# Altium schematic sheet Sheet-ForNAProj.SchDoc
size B; SheetNumber: 1; SheetTotal: 1; SPICEModelCacheKCHORGNF: <root> / <DocumentId>KCHORGNF</DocumentId> / <CacheFrame Number="0"> / <Model Name="led0" Kind="MDL"> / <Text>*Typ INFRARED GaAs LED: Vf=1.2V Vr=5V If=40mA trr=3uS / *LED Pinout: 1=A, 2=K / .MODEL LED0 D (IS=93.5P RS=84M N=2.63 BV=5 IBV=10U / + CJO=2.97P VJ=.75 M=.333 TT=4.32U)</Text> / </Model> / <Model Name="xtal" Kind="CKT"> / <Text>*Generic type:crystal pkg:HC33/51 / .SUBCKT XTAL 1 2 PARAMS: FREQ=1Meg RS=750 C=13pf Q=1000 / LX 1 3 {((Q*RS)/(6.2831852*FREQ))} IC=0.5M / CX 3 4 {(1/(Q*6.2831852*FREQ*RS))} / C0 1 2 {C} / RS 4 2 {RS} / .ENDS XTAL</Text> / </Model> / <Model Name="1n4007" Kind="MDL"> / <Text>*1N4007 MCE 8-16-95 / *1000V 1A Si GenPurpose Diode pkg:DIODE0.4 1,2 / .MODEL 1N4007 D(IS=2.55E-9 RS=0.042 N=1.75 TT=5.76E-6 CJO=1.85E-11 / + VJ=0.75 M=0.333 BV=1000 IBV=9.86E-5 )</Text> / </Model> / </CacheFrame> / </root>
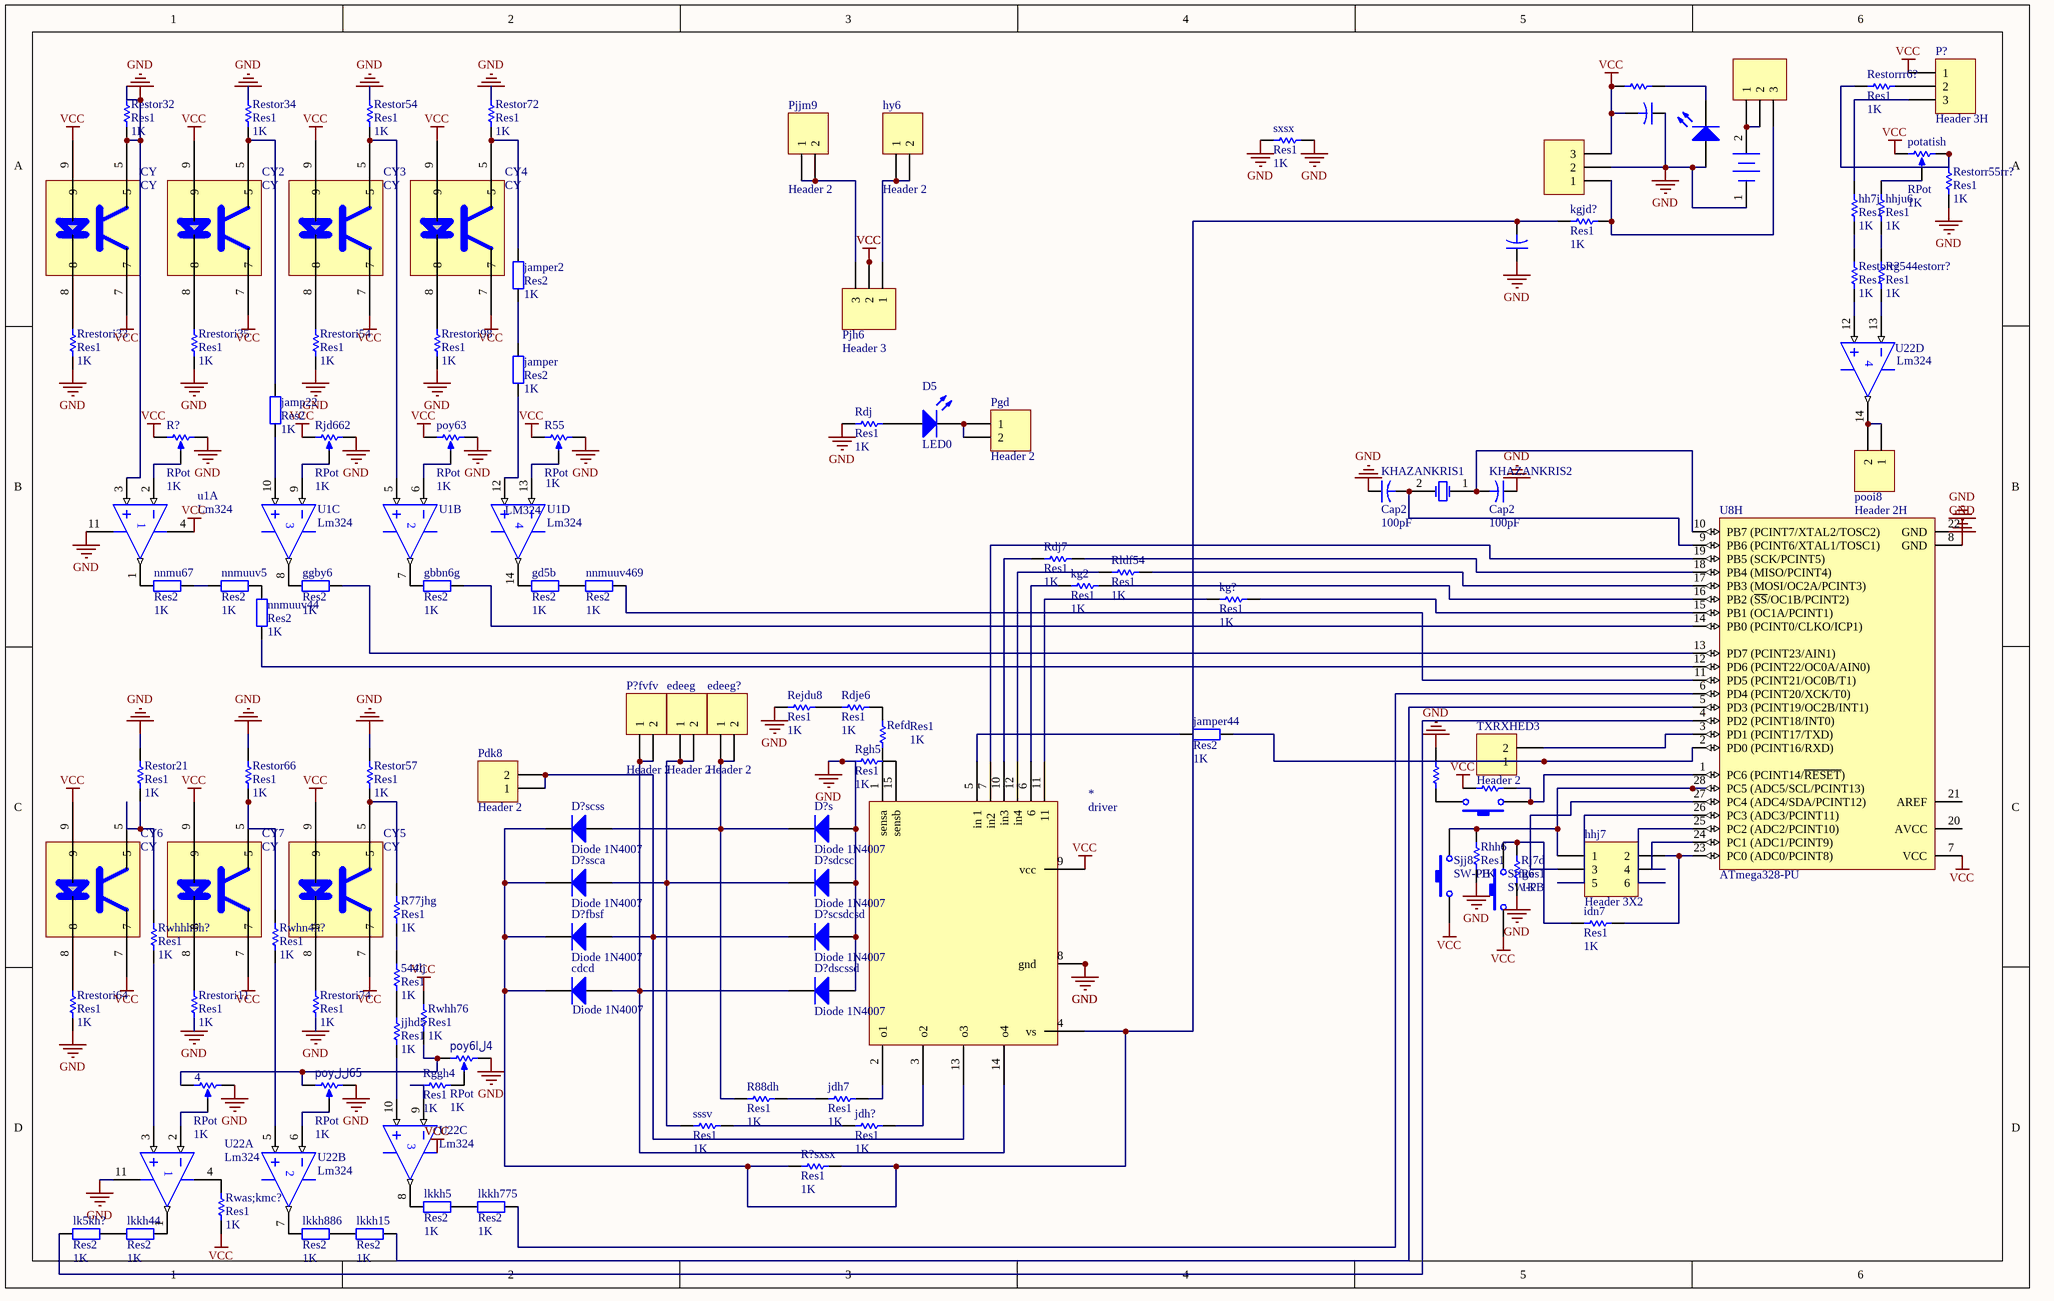
[diagram p0: Sheet-ForNAProj.SchDoc]

## Parts
4  RPot  value 1K  [VR5]
544lj  Res1  value 1K  [AXIAL-0.3]
*  driver  [PCBComponent_1]
cdcd  Diode 1N4007  [DO-41]
CMain?  Cap2IN  [CAPR5-4X5]  (value not drawn)
CMainb?  Cap2IN  [CAPR5-4X5]  (value not drawn)
CY  CY  [CY70]
CY2  CY  [CY70]
CY3  CY  [CY70]
CY4  CY  [CY70]
CY5  CY  [CY70]
CY6  CY  [CY70]
CY7  CY  [CY70]
D5  LED0  [LED-0]
D?dscssd  Diode 1N4007  [DO-41]
D?fbsf  Diode 1N4007  [DO-41]
D?s  Diode 1N4007  [DO-41]
D?scsdcsd  Diode 1N4007  [DO-41]
D?scss  Diode 1N4007  [DO-41]
D?sdcsc  Diode 1N4007  [DO-41]
D?ssca  Diode 1N4007  [DO-41]
edeeg  Header 2  [HDR1X2]
edeeg?  Header 2  [HDR1X2]
gbbn6g  Res2  value 1K  [AXIAL-0.4]
gd5b  Res2  value 1K  [AXIAL-0.4]
ggby6  Res2  value 1K  [AXIAL-0.4]
hh7j  Res1  value 1K  [AXIAL-0.3]
hhj7  Header 3X2  [HDR2X3]
hhju6  Res1  value 1K  [AXIAL-0.3]
hy6  Header 2  [HDR1X2]
idn7  Res1  value 1K  [AXIAL-0.3]
jamp22  Res2  value 1K  [AXIAL-0.4]
jamper  Res2  value 1K  [AXIAL-0.4]
jamper2  Res2  value 1K  [AXIAL-0.4]
jamper44  Res2  value 1K  [AXIAL-0.4]
jdh7  Res1  value 1K  [AXIAL-0.3]
jdh?  Res1  value 1K  [AXIAL-0.3]
jjhd5  Res1  value 1K  [AXIAL-0.3]
KEYM  Header 3  [HDR1X3]  (value not drawn)
kg2  Res1  value 1K  [AXIAL-0.3]
kg?  Res1  value 1K  [AXIAL-0.3]
kgjd?  Res1  value 1K  [AXIAL-0.3]
KHAZANKRIS1  Cap2  value 100pF  [CAPR5-4X5]
KHAZANKRIS2  Cap2  value 100pF  [CAPR5-4X5]
LEDMIAN  LED0  [LED-0]  (value not drawn)
lk5kh?  Res2  value 1K  [AXIAL-0.4]
lkkh5  Res2  value 1K  [AXIAL-0.4]
lkkh15  Res2  value 1K  [AXIAL-0.4]
lkkh44  Res2  value 1K  [AXIAL-0.4]
lkkh775  Res2  value 1K  [AXIAL-0.4]
lkkh886  Res2  value 1K  [AXIAL-0.4]
Main_BT_9_-_15_V  Battery Main  [BAT-2]  (value not drawn)
nnmu67  Res2  value 1K  [AXIAL-0.4]
nnmuuv5  Res2  value 1K  [AXIAL-0.4]
nnmuuv44  Res2  value 1K  [AXIAL-0.4]
nnmuuv469  Res2  value 1K  [AXIAL-0.4]
P?  Header 3H  [HDR1X3H]
P?fvfv  Header 2  [HDR1X2]
Pdk8  Header 2  [HDR1X2]
Pgd  Header 2  [HDR1X2]
Pjh6  Header 3  [HDR1X3]
Pjjm9  Header 2  [HDR1X2]
pooi8  Header 2H  [HDR1X2H]
potatish  RPot  value 1K  [VR5]
poy6ال4  RPot  value 1K  [VR5]
poy63  RPot  value 1K  [VR5]
poyلل65  RPot  value 1K  [VR5]
R55  RPot  value 1K  [VR5]
R77jhg  Res1  value 1K  [AXIAL-0.3]
R88dh  Res1  value 1K  [AXIAL-0.3]
R?  RPot  value 1K  [VR5]
R?sxsx  Res1  value 1K  [AXIAL-0.3]
Rdj  Res1  value 1K  [AXIAL-0.3]
Rdj7  Res1  value 1K  [AXIAL-0.3]
Rdje6  Res1  value 1K  [AXIAL-0.3]
Refd  Res1  value 1K  [AXIAL-0.3]
regolator  Header 3  [HDR1X3]  (value not drawn)
Rejdu8  Res1  value 1K  [AXIAL-0.3]
Res_LED  Res 220 LED  [AXIAL-0.3]  (value not drawn)
RESF210K  Res1  [AXIAL-0.3]  (value not drawn)
REST3100  Res1  [AXIAL-0.3]  (value not drawn)
Restor21  Res1  value 1K  [AXIAL-0.3]
Restor32  Res1  value 1K  [AXIAL-0.3]
Restor34  Res1  value 1K  [AXIAL-0.3]
Restor54  Res1  value 1K  [AXIAL-0.3]
Restor57  Res1  value 1K  [AXIAL-0.3]
Restor66  Res1  value 1K  [AXIAL-0.3]
Restor72  Res1  value 1K  [AXIAL-0.3]
Restorr55rr?  Res1  value 1K  [AXIAL-0.3]
Restorr?  Res1  value 1K  [AXIAL-0.3]
Restorrr6?  Res1  value 1K  [AXIAL-0.3]
Rg544estorr?  Res1  value 1K  [AXIAL-0.3]
Rggh4  Res1  value 1K  [AXIAL-0.3]
Rgh5  Res1  value 1K  [AXIAL-0.3]
Rhh6  Res1  value 1K  [AXIAL-0.3]
Rj7d  Res1  value 1K  [AXIAL-0.3]
Rjd662  RPot  value 1K  [VR5]
Rldf54  Res1  value 1K  [AXIAL-0.3]
Rrestori11  Res1  value 1K  [AXIAL-0.3]
Rrestori33  Res1  value 1K  [AXIAL-0.3]
Rrestori35  Res1  value 1K  [AXIAL-0.3]
Rrestori54  Res1  value 1K  [AXIAL-0.3]
Rrestori64  Res1  value 1K  [AXIAL-0.3]
Rrestori74  Res1  value 1K  [AXIAL-0.3]
Rrestori98  Res1  value 1K  [AXIAL-0.3]
Rwas;kmc?  Res1  value 1K  [AXIAL-0.3]
Rwhh76  Res1  value 1K  [AXIAL-0.3]
Rwhhh6h?  Res1  value 1K  [AXIAL-0.3]
Rwhn4h?  Res1  value 1K  [AXIAL-0.3]
Sffg6  SW-PB  [SPST-2]
Sjj8  SW-PB  [SPST-2]
sssv  Res1  value 1K  [AXIAL-0.3]
SWRESET  SW-PB  [SPST-2]  (value not drawn)
sxsx  Res1  value 1K  [AXIAL-0.3]
TXRXHED3  Header 2  [HDR1X2]
u1  Lm324  [Lm324]  (parts A,B,C,D of 4)
U8H  ATmega328-PU  [28P3]
U22  Lm324  [Lm324]  (parts A,B,C,D of 4)
XTAL16MG  XTAL  [R38]  (value not drawn)

## Nets
GND: 4.2(BOT) *.8(gnd) CMain?.1 CMainb?.1 CY.5 D?dscssd.1(A) D?s.1(A) D?scsdcsd.1(A) D?sdcsc.1(A) KHAZANKRIS1.1 KHAZANKRIS2.1 LEDMIAN.1(A) Main_BT_9_-_15_V.1(+) poy6ال4.2(BOT) poy63.2(BOT) poyلل65.2(BOT) R55.2(BOT) R?.2(BOT) Rdj.1 regolator.2 Rejdu8.2 REST3100.1 Restor21.2 Restor32.1 Restor32.2 Restor34.2 Restor54.2 Restor57.2 Restor66.2 Restor72.2 Restorr55rr?.2 Rgh5.1 Rhh6.1 Rj7d.1 Rjd662.2(BOT) Rrestori11.1 Rrestori33.1 Rrestori35.1 Rrestori54.1 Rrestori64.1 Rrestori74.1 Rrestori98.1 sxsx.1 sxsx.2 u1.3(IN+) u1.11(V-) U8H.8(GND) U8H.22(GND) U22.11(V-)
VCC: *.9(vcc) CMain?.2 CY.7 CY.9 CY2.7 CY2.9 CY3.7 CY3.9 CY4.7 CY4.9 CY5.7 CY5.9 CY6.7 CY6.9 CY7.7 CY7.9 P?.1 Pjh6.2 potatish.1(TOP) poy63.1(TOP) R55.1(TOP) R?.1(TOP) regolator.3 Res_LED.1 RESF210K.1 Rjd662.1(TOP) Rwas;kmc?.2 Rwhh76.1 Sffg6.1 Sjj8.1 u1.4(V+) U8H.7(VCC)
Net4_1: 4.1(TOP) poy6ال4.1(TOP) poyلل65.1(TOP) Rwhh76.2
Net4_3: 4.3(TAP) U22.2(IN-)
Net544lj_1: 544lj.1 R77jhg.2
Net544lj_2: 544lj.2 jjhd5.1
Net*_1: *.1(sensa) Refd.1
Net*_2: *.2(o1) jdh7.2
Net*_3: *.3(o2) jdh?.2
Net*_4: *.4(vs) cdcd.2(K) CMainb?.2 D?fbsf.2(K) D?scss.2(K) D?ssca.2(K) kgjd?.1 R?sxsx.1 R?sxsx.2
Net*_5: *.5(in_1) jamper44.1
Net*_6: *.6 kg2.2
Net*_7: *.7(in2) U8H.19(PB5_(SCK/PCINT5))
Net*_10: *.10(in3) Rdj7.2
Net*_11: *.11 kg?.2
Net*_12: *.12(in4) Rldf54.2
Net*_13: *.13(o3) D?fbsf.1(A) D?scsdcsd.2(K) Pdk8.1 Pdk8.2
Net*_14: *.14(o4) cdcd.1(A) D?dscssd.2(K) P?fvfv.1 P?fvfv.2
Net*_15: *.15(sensb) Rgh5.2
NetCY2_5: CY2.5 jamp22.2 Restor34.1
NetCY2_8: CY2.8 Rrestori35.2
NetCY3_5: CY3.5 Restor54.1 U1.5(IN+)
NetCY3_8: CY3.8 Rrestori54.2
NetCY4_5: CY4.5 jamper2.2 Restor72.1
NetCY4_8: CY4.8 Rrestori98.2
NetCY5_5: CY5.5 R77jhg.1 Restor57.1
NetCY5_8: CY5.8 Rrestori74.2
NetCY6_5: CY6.5 Restor21.1 Rwhhh6h?.1
NetCY6_8: CY6.8 Rrestori64.2
NetCY7_5: CY7.5 Restor66.1 Rwhn4h?.1
NetCY7_8: CY7.8 Rrestori11.2
NetCY_8: CY.8 Rrestori33.2
NetD5_1: D5.1(A) Rdj.2
NetD5_2: D5.2(K) Pgd.1 Pgd.2
NetD?s_2: D?s.2(K) D?scss.1(A) edeeg?.1 edeeg?.2 R88dh.1
NetD?sdcsc_2: D?sdcsc.2(K) D?ssca.1(A) edeeg.1 edeeg.2 sssv.1
Netgbbn6g_1: gbbn6g.1 U1.7(OUT)
Netgbbn6g_2: gbbn6g.2 U8H.14(PB0_(PCINT0/CLKO/ICP1))
Netgd5b_1: gd5b.1 U1.14(OUT)
Netgd5b_2: gd5b.2 nnmuuv469.1
Netggby6_1: ggby6.1 U1.8(OUT)
Netggby6_2: ggby6.2 U8H.13(PD7_(PCINT23/AIN1))
Nethh7j_1: hh7j.1 P?.3
Nethh7j_2: hh7j.2 Restorr?.1
Nethhj7_1: hhj7.1 Rhh6.2 Sjj8.2 U8H.28(PC5_(ADC5/SCL/PCINT13))
Nethhj7_2: hhj7.2 idn7.2 U8H.23(PC0_(ADC0/PCINT8))
Nethhj7_3: hhj7.3 U8H.27(PC4_(ADC4/SDA/PCINT12))
Nethhj7_4: hhj7.4 U8H.24(PC1_(ADC1/PCINT9))
Nethhj7_5: hhj7.5 U8H.26(PC3_(ADC3/PCINT11))
Nethhj7_6: hhj7.6 U8H.25(PC2_(ADC2/PCINT10))
Nethhju6_1: hhju6.1 Rg544estorr?.1
Nethhju6_2: hhju6.2 potatish.3(TAP)
Nethy6_1: hy6.1 hy6.2 Pjh6.1
Netidn7_1: idn7.1 Rj7d.2 Sffg6.2
Netjamp22_1: jamp22.1 U1.10(IN+)
Netjamper44_2: jamper44.2 TXRXHED3.1 U8H.2(PD0_(PCINT16/RXD))
Netjamper_1: jamper.1 U1.12(IN+)
Netjamper_2: jamper.2 jamper2.1
Netjdh7_1: jdh7.1 R88dh.2
Netjdh?_1: jdh?.1 sssv.2
Netjjhd5_2: jjhd5.2 U22.10(IN+)
NetKEYM_1: KEYM.1 KEYM.2 Main_BT_9_-_15_V.2(-)
NetKEYM_3: KEYM.3 kgjd?.2 regolator.1
Netkg2_1: kg2.1 U8H.16(PB2_(~{SS}/OC1B/PCINT2))
Netkg?_1: kg?.1 U8H.15(PB1_(OC1A/PCINT1))
NetKHAZANKRIS1_2: KHAZANKRIS1.2 U8H.9(PB6_(PCINT6/XTAL1/TOSC1)) XTAL16MG.2(OSC2)
NetKHAZANKRIS2_2: KHAZANKRIS2.2 U8H.10(PB7_(PCINT7/XTAL2/TOSC2)) XTAL16MG.1(OSC1)
NetLEDMIAN_2: LEDMIAN.2(K) Res_LED.2
Netlk5kh?_1: lk5kh?.1 U8H.4(PD2_(PCINT18/INT0))
Netlk5kh?_2: lk5kh?.2 lkkh44.1
Netlkkh5_1: lkkh5.1 U22.8(OUT)
Netlkkh5_2: lkkh5.2 lkkh775.1
Netlkkh15_1: lkkh15.1 lkkh886.2
Netlkkh15_2: lkkh15.2 U8H.5(PD3_(PCINT19/OC2B/INT1))
Netlkkh44_2: lkkh44.2 U22.1(OUT)
Netlkkh775_2: lkkh775.2 U8H.6(PD4_(PCINT20/XCK/T0))
Netlkkh886_1: lkkh886.1 U22.7(OUT)
Netnnmu67_1: nnmu67.1 u1.1(OUT)
Netnnmu67_2: nnmu67.2 nnmuuv5.1
Netnnmuuv5_2: nnmuuv5.2 nnmuuv44.2
Netnnmuuv44_1: nnmuuv44.1 U8H.12(PD6_(PCINT22/OC0A/AIN0))
Netnnmuuv469_2: nnmuuv469.2 U8H.11(PD5_(PCINT21/OC0B/T1))
NetP?_2: P?.2 Restorrr6?.1
NetPjh6_3: Pjh6.3 Pjjm9.1 Pjjm9.2
Netpooi8_1: pooi8.1 pooi8.2 U22.14(OUT)
Netpotatish_2: potatish.2(BOT) Restorr55rr?.1 Restorrr6?.2
Netpoy6ال4_3: poy6ال4.3(TAP) Rggh4.2
Netpoy63_3: poy63.3(TAP) U1.6(IN-)
Netpoyلل65_3: poyلل65.3(TAP) U22.6(IN-)
NetR55_3: R55.3(TAP) U1.13(IN-)
NetR?_3: R?.3(TAP) u1.2(IN-)
NetRdj7_1: Rdj7.1 U8H.18(PB4_(MISO/PCINT4))
NetRdje6_1: Rdje6.1 Refd.2
NetRdje6_2: Rdje6.2 Rejdu8.1
NetRESF210K_2: RESF210K.2 SWRESET.1 U8H.1(PC6_(PCINT14/~{RESET}))
NetREST3100_2: REST3100.2 SWRESET.2
NetRestorr?_2: Restorr?.2 U22.12(IN+)
NetRg544estorr?_2: Rg544estorr?.2 U22.13(IN-)
NetRggh4_1: Rggh4.1 U22.9(IN-)
NetRjd662_3: Rjd662.3(TAP) U1.9(IN-)
NetRldf54_1: Rldf54.1 U8H.17(PB3_(MOSI/OC2A/PCINT3))
NetRwas;kmc?_1: Rwas;kmc?.1 U22.4(V+)
NetRwhhh6h?_2: Rwhhh6h?.2 U22.3(IN+)
NetRwhn4h?_2: Rwhn4h?.2 U22.5(IN+)
NetTXRXHED3_2: TXRXHED3.2 U8H.3(PD1_(PCINT17/TXD))

Not connected (* = marked no-connect by the designer): U8H 20(AVCC) 21(AREF)

## Library data of the parts
4 potatish poy6ال4 poy63 poyلل65 R55 R? Rjd662 = RPot: Potentiometer; Sim Note: Enter the Resistance value and the set point into parameter fields.; Set Position: 0.5; Published: 8-Jun-2000; LatestRevisionDate: 17-Jul-2002; LatestRevisionNote: Re-released for DXP Platform.; PackageReference: VR5; Publisher: Altium Limited; PackageDescription: Variable Resistor, Thru-Hole; 3 Leads
544lj hh7j hhju6 idn7 jdh7 jdh? jjhd5 kg2 kg? kgjd? R77jhg R88dh R?sxsx Rdj Rdj7 Rdje6 Refd Rejdu8 Restor21 Restor32 Restor34 Restor54 Restor57 Restor66 Restor72 Restorr55rr? Restorr? Restorrr6? Rg544estorr? Rggh4 Rgh5 Rhh6 Rj7d Rldf54 Rrestori11 Rrestori33 Rrestori35 Rrestori54 Rrestori64 Rrestori74 Rrestori98 Rwas;kmc? Rwhh76 Rwhhh6h? Rwhn4h? sssv sxsx = Res1: Resistor; Published: 8-Jun-2000; LatestRevisionDate: 17-Jul-2002; LatestRevisionNote: Re-released for DXP Platform.; PackageReference: AXIAL-0.3; Publisher: Altium Limited; PackageDescription: Axial Device, Thru-Hole; 2 Leads; 0.3 in Pin Spacing
cdcd D?dscssd D?fbsf D?s D?scsdcsd D?scss D?sdcsc D?ssca = Diode 1N4007: 1 Amp General Purpose Rectifier; Published: 8-Jun-2000; LatestRevisionDate: 17-Jul-2002; LatestRevisionNote: Re-released for DXP Platform.; DatasheetVersion: 1998; PackageVersion: Aug-1999; PackageReference: DO-41; Publisher: Altium Limited; PackageDescription: Diode, Axial; Body 5.2 x 2.7 mm (LxDia. max), Lead Dia. 0.86 mm (max); Code_JEDEC: DO-204-AL; ComponentLink1Description: Manufacturer Link; ComponentLink1URL: http://www.fairchildsemi.com/; ComponentLink2Description: Datasheet; ComponentLink2URL: http://www.fairchildsemi.com/ds/1N%2F1N4001.pdf
CMain? CMainb? = Cap2: Capacitor; Value: 100pF; Published: 23-Sep-2002; PackageReference: CAPR5-4X5; Publisher: Altium Limited; PackageDescription: Capacitor; 2 Leads
CY CY2-CY7 = CY70: LED MADON
D5 LEDMIAN = LED0: Typical INFRARED GaAs LED; Published: 8-Jun-2000; LatestRevisionDate: 08-Jul-2005; LatestRevisionNote: Mech Layer 1 removed.; PackageReference: LED-0; Publisher: Altium Limited; PackageDescription: LED; 2 Leads
edeeg edeeg? hy6 P?fvfv Pdk8 Pgd Pjjm9 TXRXHED3 = Header 2: Header, 2-Pin; LatestRevisionDate: 17-Jul-2002; LatestRevisionNote: Re-released for DXP Platform.; Publisher: Altium Limited
gbbn6g gd5b ggby6 jamp22 jamper jamper2 jamper44 lk5kh? lkkh5 lkkh15 lkkh44 lkkh775 lkkh886 nnmu67 nnmuuv5 nnmuuv44 nnmuuv469 = Res2: Resistor; Published: 8-Jun-2000; LatestRevisionDate: 17-Jul-2002; LatestRevisionNote: Re-released for DXP Platform.; PackageReference: AXIAL-0.4; Publisher: Altium Limited; PackageDescription: Axial Device, Thru-Hole; 2 Leads; 0.4 in Pin Spacing
hhj7 = Header 3X2: Header, 3-Pin, Dual row; LatestRevisionDate: 17-Jul-2002; LatestRevisionNote: Re-released for DXP Platform.; Publisher: Altium Limited
KEYM Pjh6 regolator = Header 3: Header, 3-Pin; LatestRevisionDate: 17-Jul-2002; LatestRevisionNote: Re-released for DXP Platform.; Publisher: Altium Limited
KHAZANKRIS1 KHAZANKRIS2 = Cap2: Capacitor; Published: 23-Sep-2002; PackageReference: CAPR5-4X5; Publisher: Altium Limited; PackageDescription: Capacitor; 2 Leads
Main_BT_9_-_15_V = Battery: Multicell Battery; Published: 24-Mar-1999; LatestRevisionDate: 17-Jul-2002; LatestRevisionNote: Re-released for DXP Platform.; PackageReference: BAT-2; Publisher: Altium Limited; PackageDescription: Battery; 2 Leads
P? = Header 3H: Header, 3-Pin, Right Angle; LatestRevisionDate: 17-Jul-2002; LatestRevisionNote: Re-released for DXP Platform.; Publisher: Altium Limited
pooi8 = Header 2H: Header, 2-Pin, Right Angle; LatestRevisionDate: 17-Jul-2002; LatestRevisionNote: Re-released for DXP Platform.; Publisher: Altium Limited
Res_LED = Res1: Resistor; Value: 220; Published: 8-Jun-2000; LatestRevisionDate: 17-Jul-2002; LatestRevisionNote: Re-released for DXP Platform.; PackageReference: AXIAL-0.3; Publisher: Altium Limited; PackageDescription: Axial Device, Thru-Hole; 2 Leads; 0.3 in Pin Spacing
RESF210K REST3100 = Res1: Resistor; Value: 1K; Published: 8-Jun-2000; LatestRevisionDate: 17-Jul-2002; LatestRevisionNote: Re-released for DXP Platform.; PackageReference: AXIAL-0.3; Publisher: Altium Limited; PackageDescription: Axial Device, Thru-Hole; 2 Leads; 0.3 in Pin Spacing
Sffg6 Sjj8 SWRESET = SW-PB: Switch; Published: 24-Mar-1999; LatestRevisionDate: 17-Jul-2002; LatestRevisionNote: Re-released for DXP Platform.; PackageReference: SPST-2; Publisher: Altium Limited; PackageDescription: Switch; 2 Leads
u1 U22 = LM324: Tel: 05132244449; Creator: www.ALIAco.ir
U8H = ATmega328-PU: 8-bit AVR Microcontroller, 32KB Flash, 1KB EEPROM, 2KB SRAM, 28-pin PDIP, Industrial Grade (-40°C to 85°C); DatasheetVersion: revD, May-2011; PackageVersion: revB, Sep-2001; PackageReference: 28P3; PackageDescription: 28-lead (0.300"/7.62mm Wide) Plastic Dual Inline Package (PDIP); ComponentLink1Description: Manufacturer URL; ComponentLink1URL: http://www.atmel.com/; ComponentLink2Description: ATmega48A/48PA/88A/88PA/168A/168PA/328/328P Datasheet; ComponentLink2URL: http://www.atmel.com/dyn/resources/prod_documents/8271.pdf; ComponentLink3Description: ATmega48A/48PA/88A/88PA/168A/168PA/328/328P Summary; ComponentLink3URL: http://www.atmel.com/dyn/resources/prod_documents/8271S.pdf
XTAL16MG = XTAL: Crystal Oscillator; Published: 8-Jun-2000; LatestRevisionDate: 17-Jul-2002; LatestRevisionNote: Re-released for DXP Platform.; PackageReference: R38; Publisher: Altium Limited; PackageDescription: Crystal, Thru-Hole; 2 Leads; Body 3.1 x 8.2 mm (Dia.xH)